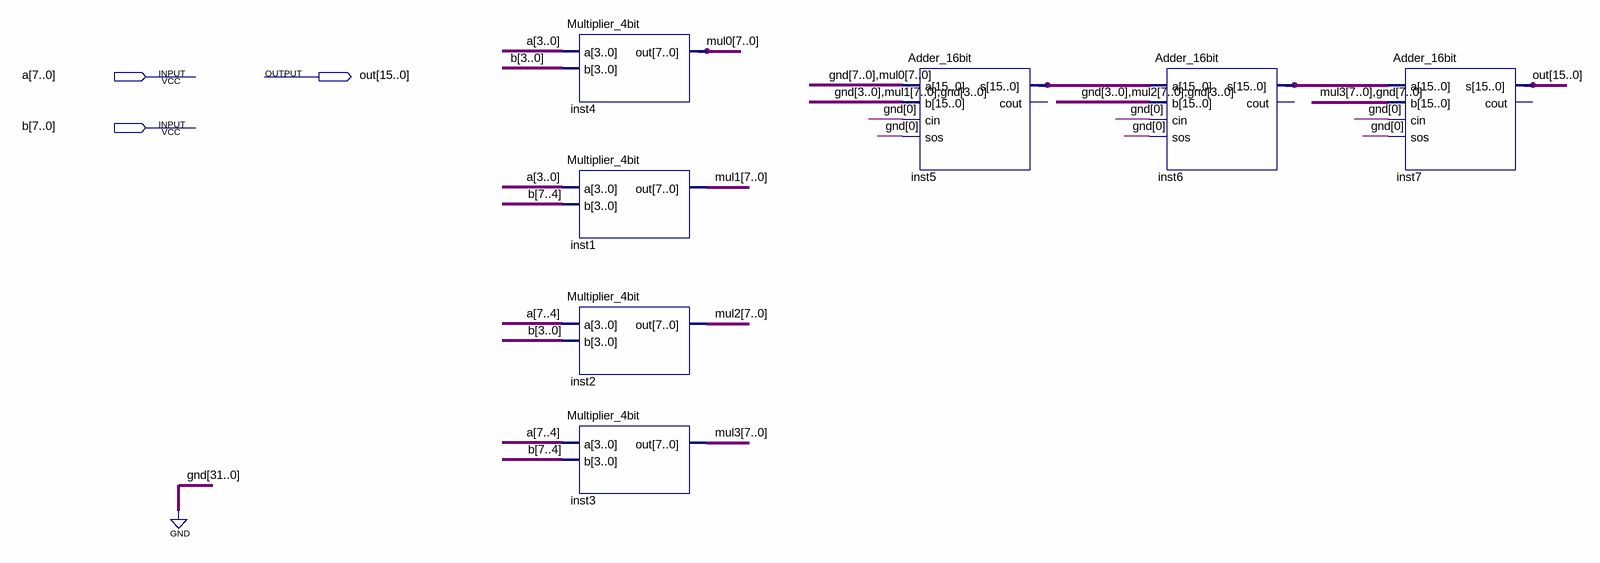
[diagram p0: schematic sheet]
// Quartus schematic Multiplier_8bit.bdf as structural Verilog: 7 symbols, 3 pins
module Multiplier_8bit (
  input  [7:0] a,
  input  [7:0] b,
  output [15:0] out
);

  wire [7:0] mul0, mul1, mul2, mul3;
  wire [15:0] inst5_s, inst6_s;

  Multiplier_4bit inst4 (.a(a[3:0]), .b(b[3:0]), .out(mul0));
  Multiplier_4bit inst1 (.a(a[3:0]), .b(b[7:4]), .out(mul1));
  Multiplier_4bit inst2 (.a(a[7:4]), .b(b[3:0]), .out(mul2));
  Multiplier_4bit inst3 (.a(a[7:4]), .b(b[7:4]), .out(mul3));
  Adder_16bit inst5 (
    .a({{8{1'b0}}, mul0}), .b({4'b0000, mul1, 4'b0000}), .cin(1'b0), .sos(1'b0), .s(inst5_s));  // open: cout
  Adder_16bit inst6 (.a(inst5_s), .b({4'b0000, mul2, 4'b0000}), .cin(1'b0), .sos(1'b0), .s(inst6_s));  // open: cout
  Adder_16bit inst7 (.a(inst6_s), .b({mul3, {8{1'b0}}}), .cin(1'b0), .sos(1'b0), .s(out));  // open: cout
endmodule
